# Altium schematic sheet 4_Mosfet.SchDoc
size A; SheetNumber: 3; SheetTotal: 5
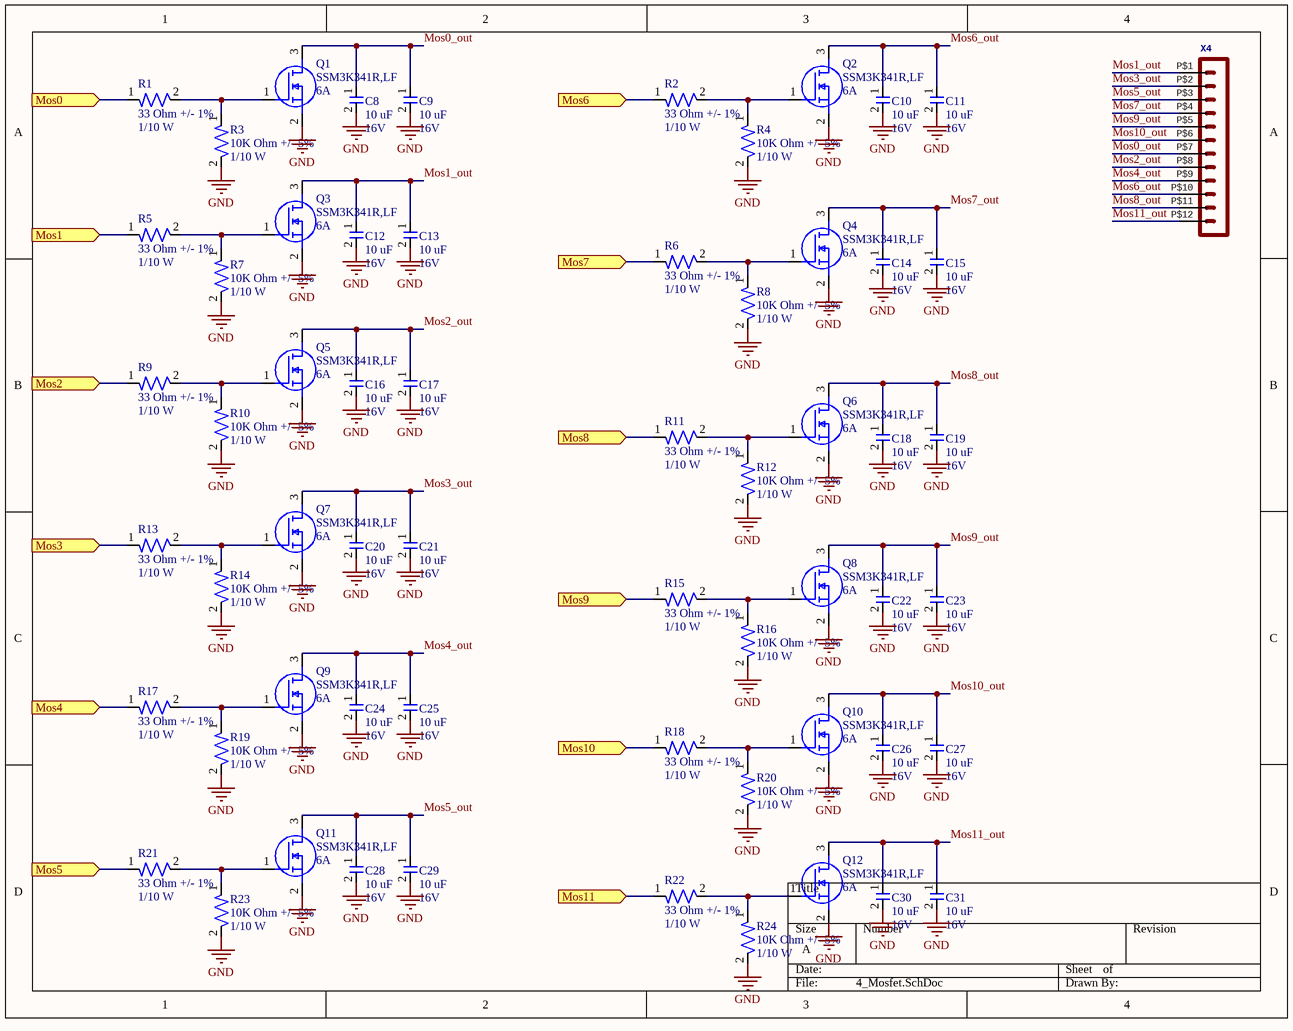
[diagram p0: 4_Mosfet.SchDoc]

## Parts
C8  Capacitance: 10 uF  Voltage Rating: 16V  [CAP-0805]  (hidden comment: CL21A106KOQNNNE)
C9  Capacitance: 10 uF  Voltage Rating: 16V  [CAP-0805]  (hidden comment: CL21A106KOQNNNE)
C10  Capacitance: 10 uF  Voltage Rating: 16V  [CAP-0805]  (hidden comment: CL21A106KOQNNNE)
C11  Capacitance: 10 uF  Voltage Rating: 16V  [CAP-0805]  (hidden comment: CL21A106KOQNNNE)
C12  Capacitance: 10 uF  Voltage Rating: 16V  [CAP-0805]  (hidden comment: CL21A106KOQNNNE)
C13  Capacitance: 10 uF  Voltage Rating: 16V  [CAP-0805]  (hidden comment: CL21A106KOQNNNE)
C14  Capacitance: 10 uF  Voltage Rating: 16V  [CAP-0805]  (hidden comment: CL21A106KOQNNNE)
C15  Capacitance: 10 uF  Voltage Rating: 16V  [CAP-0805]  (hidden comment: CL21A106KOQNNNE)
C16  Capacitance: 10 uF  Voltage Rating: 16V  [CAP-0805]  (hidden comment: CL21A106KOQNNNE)
C17  Capacitance: 10 uF  Voltage Rating: 16V  [CAP-0805]  (hidden comment: CL21A106KOQNNNE)
C18  Capacitance: 10 uF  Voltage Rating: 16V  [CAP-0805]  (hidden comment: CL21A106KOQNNNE)
C19  Capacitance: 10 uF  Voltage Rating: 16V  [CAP-0805]  (hidden comment: CL21A106KOQNNNE)
C20  Capacitance: 10 uF  Voltage Rating: 16V  [CAP-0805]  (hidden comment: CL21A106KOQNNNE)
C21  Capacitance: 10 uF  Voltage Rating: 16V  [CAP-0805]  (hidden comment: CL21A106KOQNNNE)
C22  Capacitance: 10 uF  Voltage Rating: 16V  [CAP-0805]  (hidden comment: CL21A106KOQNNNE)
C23  Capacitance: 10 uF  Voltage Rating: 16V  [CAP-0805]  (hidden comment: CL21A106KOQNNNE)
C24  Capacitance: 10 uF  Voltage Rating: 16V  [CAP-0805]  (hidden comment: CL21A106KOQNNNE)
C25  Capacitance: 10 uF  Voltage Rating: 16V  [CAP-0805]  (hidden comment: CL21A106KOQNNNE)
C26  Capacitance: 10 uF  Voltage Rating: 16V  [CAP-0805]  (hidden comment: CL21A106KOQNNNE)
C27  Capacitance: 10 uF  Voltage Rating: 16V  [CAP-0805]  (hidden comment: CL21A106KOQNNNE)
C28  Capacitance: 10 uF  Voltage Rating: 16V  [CAP-0805]  (hidden comment: CL21A106KOQNNNE)
C29  Capacitance: 10 uF  Voltage Rating: 16V  [CAP-0805]  (hidden comment: CL21A106KOQNNNE)
C30  Capacitance: 10 uF  Voltage Rating: 16V  [CAP-0805]  (hidden comment: CL21A106KOQNNNE)
C31  Capacitance: 10 uF  Voltage Rating: 16V  [CAP-0805]  (hidden comment: CL21A106KOQNNNE)
Q1  SSM3K341R,LF  Id: 6A  [NMOS-SOT23-3]
Q2  SSM3K341R,LF  Id: 6A  [NMOS-SOT23-3]
Q3  SSM3K341R,LF  Id: 6A  [NMOS-SOT23-3]
Q4  SSM3K341R,LF  Id: 6A  [NMOS-SOT23-3]
Q5  SSM3K341R,LF  Id: 6A  [NMOS-SOT23-3]
Q6  SSM3K341R,LF  Id: 6A  [NMOS-SOT23-3]
Q7  SSM3K341R,LF  Id: 6A  [NMOS-SOT23-3]
Q8  SSM3K341R,LF  Id: 6A  [NMOS-SOT23-3]
Q9  SSM3K341R,LF  Id: 6A  [NMOS-SOT23-3]
Q10  SSM3K341R,LF  Id: 6A  [NMOS-SOT23-3]
Q11  SSM3K341R,LF  Id: 6A  [NMOS-SOT23-3]
Q12  SSM3K341R,LF  Id: 6A  [NMOS-SOT23-3]
R1  Resistance: 33 Ohm +/- 1%  Power: 1/10 W  [RES-0402]  (hidden comment: ERJ2RKF33R0X)
R2  Resistance: 33 Ohm +/- 1%  Power: 1/10 W  [RES-0402]  (hidden comment: ERJ2RKF33R0X)
R3  Resistance: 10K Ohm +/- 5%  Power: 1/10 W  [RES-0402]  (hidden comment: ERJ2GEJ103X)
R4  Resistance: 10K Ohm +/- 5%  Power: 1/10 W  [RES-0402]  (hidden comment: ERJ2GEJ103X)
R5  Resistance: 33 Ohm +/- 1%  Power: 1/10 W  [RES-0402]  (hidden comment: ERJ2RKF33R0X)
R6  Resistance: 33 Ohm +/- 1%  Power: 1/10 W  [RES-0402]  (hidden comment: ERJ2RKF33R0X)
R7  Resistance: 10K Ohm +/- 5%  Power: 1/10 W  [RES-0402]  (hidden comment: ERJ2GEJ103X)
R8  Resistance: 10K Ohm +/- 5%  Power: 1/10 W  [RES-0402]  (hidden comment: ERJ2GEJ103X)
R9  Resistance: 33 Ohm +/- 1%  Power: 1/10 W  [RES-0402]  (hidden comment: ERJ2RKF33R0X)
R10  Resistance: 10K Ohm +/- 5%  Power: 1/10 W  [RES-0402]  (hidden comment: ERJ2GEJ103X)
R11  Resistance: 33 Ohm +/- 1%  Power: 1/10 W  [RES-0402]  (hidden comment: ERJ2RKF33R0X)
R12  Resistance: 10K Ohm +/- 5%  Power: 1/10 W  [RES-0402]  (hidden comment: ERJ2GEJ103X)
R13  Resistance: 33 Ohm +/- 1%  Power: 1/10 W  [RES-0402]  (hidden comment: ERJ2RKF33R0X)
R14  Resistance: 10K Ohm +/- 5%  Power: 1/10 W  [RES-0402]  (hidden comment: ERJ2GEJ103X)
R15  Resistance: 33 Ohm +/- 1%  Power: 1/10 W  [RES-0402]  (hidden comment: ERJ2RKF33R0X)
R16  Resistance: 10K Ohm +/- 5%  Power: 1/10 W  [RES-0402]  (hidden comment: ERJ2GEJ103X)
R17  Resistance: 33 Ohm +/- 1%  Power: 1/10 W  [RES-0402]  (hidden comment: ERJ2RKF33R0X)
R18  Resistance: 33 Ohm +/- 1%  Power: 1/10 W  [RES-0402]  (hidden comment: ERJ2RKF33R0X)
R19  Resistance: 10K Ohm +/- 5%  Power: 1/10 W  [RES-0402]  (hidden comment: ERJ2GEJ103X)
R20  Resistance: 10K Ohm +/- 5%  Power: 1/10 W  [RES-0402]  (hidden comment: ERJ2GEJ103X)
R21  Resistance: 33 Ohm +/- 1%  Power: 1/10 W  [RES-0402]  (hidden comment: ERJ2RKF33R0X)
R22  Resistance: 33 Ohm +/- 1%  Power: 1/10 W  [RES-0402]  (hidden comment: ERJ2RKF33R0X)
R23  Resistance: 10K Ohm +/- 5%  Power: 1/10 W  [RES-0402]  (hidden comment: ERJ2GEJ103X)
R24  Resistance: 10K Ohm +/- 5%  Power: 1/10 W  [RES-0402]  (hidden comment: ERJ2GEJ103X)
X4  Molex - Micro-Fit 3.0 Series connector,  3.00mm (0.118") pitch header, 12 positions.  [43045-1212]  (value not drawn)

## Ports
Mos0 (in), Mos1 (in), Mos2 (in), Mos3 (in), Mos4 (in), Mos5 (in), Mos6 (in), Mos7 (in), Mos8 (in), Mos9 (in), Mos10 (in), Mos11 (in)

## Nets
GND: C8.2 C9.2 C10.2 C11.2 C12.2 C13.2 C14.2 C15.2 C16.2 C17.2 C18.2 C19.2 C20.2 C21.2 C22.2 C23.2 C24.2 C25.2 C26.2 C27.2 C28.2 C29.2 C30.2 C31.2 Q1.2(S) Q2.2(S) Q3.2(S) Q4.2(S) Q5.2(S) Q6.2(S) Q7.2(S) Q8.2(S) Q9.2(S) Q10.2(S) Q11.2(S) Q12.2(S) R3.2 R4.2 R7.2 R8.2 R10.2 R12.2 R14.2 R16.2 R19.2 R20.2 R23.2 R24.2
Mos0: R1.1 ; port Mos0
Mos0_out: C8.1 C9.1 Q1.3(D) X4.P$7
Mos1: R5.1 ; port Mos1
Mos1_out: C12.1 C13.1 Q3.3(D) X4.P$1
Mos2: R9.1 ; port Mos2
Mos2_out: C16.1 C17.1 Q5.3(D) X4.P$8
Mos3: R13.1 ; port Mos3
Mos3_out: C20.1 C21.1 Q7.3(D) X4.P$2
Mos4: R17.1 ; port Mos4
Mos4_out: C24.1 C25.1 Q9.3(D) X4.P$9
Mos5: R21.1 ; port Mos5
Mos5_out: C28.1 C29.1 Q11.3(D) X4.P$3
Mos6: R2.1 ; port Mos6
Mos6_out: C10.1 C11.1 Q2.3(D) X4.P$10
Mos7: R6.1 ; port Mos7
Mos7_out: C14.1 C15.1 Q4.3(D) X4.P$4
Mos8: R11.1 ; port Mos8
Mos8_out: C18.1 C19.1 Q6.3(D) X4.P$11
Mos9: R15.1 ; port Mos9
Mos9_out: C22.1 C23.1 Q8.3(D) X4.P$5
Mos10: R18.1 ; port Mos10
Mos10_out: C26.1 C27.1 Q10.3(D) X4.P$6
Mos11: R22.1 ; port Mos11
Mos11_out: C30.1 C31.1 Q12.3(D) X4.P$12
NetQ1_1: Q1.1(G) R1.2 R3.1
NetQ2_1: Q2.1(G) R2.2 R4.1
NetQ3_1: Q3.1(G) R5.2 R7.1
NetQ4_1: Q4.1(G) R6.2 R8.1
NetQ5_1: Q5.1(G) R9.2 R10.1
NetQ6_1: Q6.1(G) R11.2 R12.1
NetQ7_1: Q7.1(G) R13.2 R14.1
NetQ8_1: Q8.1(G) R15.2 R16.1
NetQ9_1: Q9.1(G) R17.2 R19.1
NetQ10_1: Q10.1(G) R18.2 R20.1
NetQ11_1: Q11.1(G) R21.2 R23.1
NetQ12_1: Q12.1(G) R22.2 R24.1

## Library data of the parts
C8-C31 = CAP-10U-0002: 10 µF ±10% 16V Ceramic Capacitor X7R 0805 (2012 Metric); Package Size: 0805
Q1-Q12 = NMOS-5A-0001: N-Channel 60 V 6A (Ta) 1.2W (Ta) Surface Mount SOT-23F; Vgs: 2.5V; Vdss: 60V; RdsOn: 36mOhm; Package: SOT-23-3
R1 R2 R5 R6 R9 R11 R13 R15 R17 R18 R21 R22 = RES-33-0003-JLC: 100mW Thick Film Resistors ±100ppm/℃ ±1% -55℃~+155℃ 33Ω 0402  Chip Resistor - Surface Mount ROHS; assembled?: yes; JLC part number: C278594
R3 R4 R7 R8 R10 R12 R14 R16 R19 R20 R23 R24 = RES-10K-0003-JLC: 100mW Thick Film Resistors 100V ±5% ±200ppm/℃ -55℃~+155℃ 10kΩ 0402  Chip Resistor - Surface Mount ROHS; assembled?: yes; JLC part number: C278577
X4 = HEADER_POS12_?43045-1212: GateName_1: G$1; SymbolName_1: HEADER_POS12; DeviceName: 43045-1212; LibraryName: con-molex-micro-fit-3_0_2; DeviceSetName: HEADER_POS12_?; Package: 43045-1212